# Altium schematic sheet AD9959.SchDoc
size A4
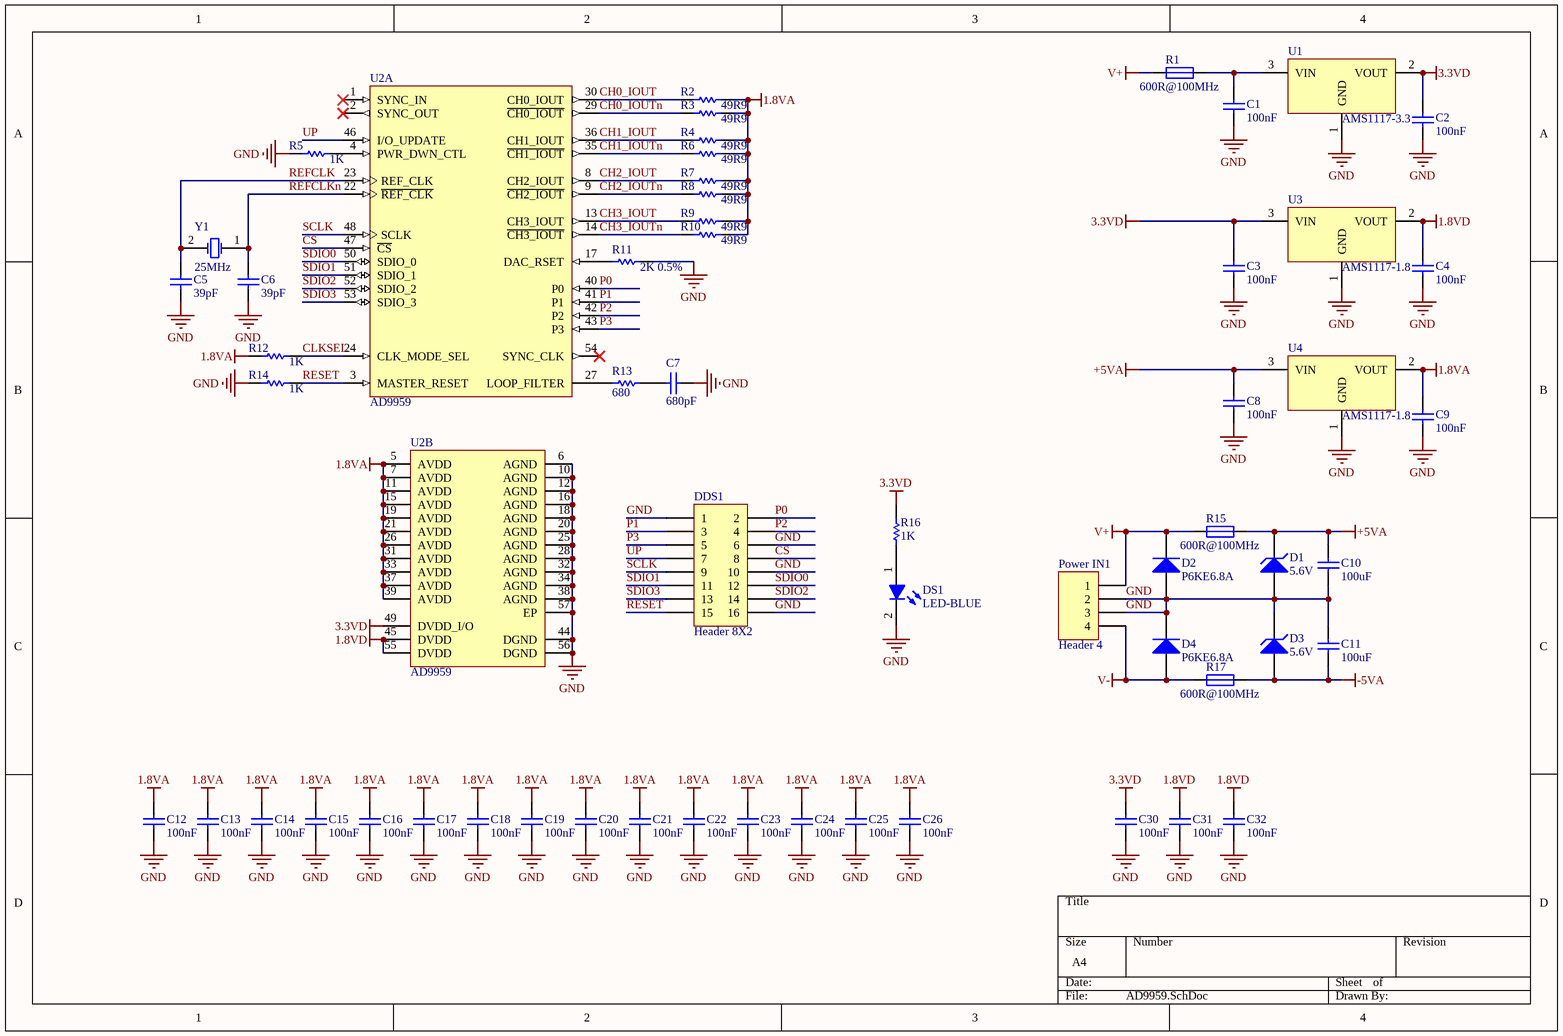
[diagram p0: AD9959.SchDoc]

## Parts
C1  100nF  [CAPC0603(1608)55_M]
C2  100nF  [CAPC0603(1608)55_M]
C3  100nF  [CAPC0603(1608)55_M]
C4  100nF  [CAPC0603(1608)55_M]
C5  39pF  [CAPC0603(1608)55_M]
C6  39pF  [CAPC0603(1608)55_M]
C7  680pF  [CAPC0603(1608)55_M]
C8  100nF  [CAPC0603(1608)55_M]
C9  100nF  [CAPC0603(1608)55_M]
C10  100uF  [CAPC3225]
C11  100uF  [CAPC3225]
C12  100nF  [CAPC0603(1608)55_M]
C13  100nF  [CAPC0603(1608)55_M]
C14  100nF  [CAPC0603(1608)55_M]
C15  100nF  [CAPC0603(1608)55_M]
C16  100nF  [CAPC0603(1608)55_M]
C17  100nF  [CAPC0603(1608)55_M]
C18  100nF  [CAPC0603(1608)55_M]
C19  100nF  [CAPC0603(1608)55_M]
C20  100nF  [CAPC0603(1608)55_M]
C21  100nF  [CAPC0603(1608)55_M]
C22  100nF  [CAPC0603(1608)55_M]
C23  100nF  [CAPC0603(1608)55_M]
C24  100nF  [CAPC0603(1608)55_M]
C25  100nF  [CAPC0603(1608)55_M]
C26  100nF  [CAPC0603(1608)55_M]
C30  100nF  [CAPC0603(1608)55_M]
C31  100nF  [CAPC0603(1608)55_M]
C32  100nF  [CAPC0603(1608)55_M]
D1  5.6V  [LL34]
D2  P6KE6.8A  [DO-214AC]
D3  5.6V  [LL34]
D4  P6KE6.8A  [DO-214AC]
DDS1  Header 8X2  [HEADER8X2]
DS1  LED-BLUE  [0603LED_BLUE_V]
Power_IN1  Header 4  [3.96-4]
R1  600R@100MHz  [RESC1206(3216)_M]
R2  49R9  [RESC0603(1608)_M]
R3  49R9  [RESC0603(1608)_M]
R4  49R9  [RESC0603(1608)_M]
R5  1K  [RESC0603(1608)_M]
R6  49R9  [RESC0603(1608)_M]
R7  49R9  [RESC0603(1608)_M]
R8  49R9  [RESC0603(1608)_M]
R9  49R9  [RESC0603(1608)_M]
R10  49R9  [RESC0603(1608)_M]
R11  2K 0.5%  [RESC0603(1608)_M]
R12  1K  [RESC0603(1608)_M]
R13  680  [RESC0603(1608)_M]
R14  1K  [RESC0603(1608)_M]
R15  600R@100MHz  [RESC1206(3216)_M]
R16  1K  [RESC0603(1608)_M]
R17  600R@100MHz  [RESC1206(3216)_M]
U1  AMS1117-3.3  [SOT-223_M]
U2  AD9959  [QFN56]  (parts A,B of 2)
U3  AMS1117-1.8  [SOT-223_M]
U4  AMS1117-1.8  [SOT-223_M]
Y1  25MHz  [HC-49S]

## Nets
1.8VA: C9.2 C12.2 C13.2 C14.2 C15.2 C16.2 C17.2 C18.2 C19.2 C20.2 C21.2 C22.2 C23.2 C24.2 C25.2 C26.2 R2.2 R3.2 R4.2 R6.2 R7.2 R8.2 R9.2 R10.2 R12.1 U2.5(AVDD) U2.7(AVDD) U2.11(AVDD) U2.15(AVDD) U2.19(AVDD) U2.21(AVDD) U2.26(AVDD) U2.31(AVDD) U2.33(AVDD) U2.37(AVDD) U2.39(AVDD) U4.2(VOUT)
1.8VD: C4.2 C31.2 C32.2 U2.45(DVDD) U2.55(DVDD) U3.2(VOUT)
3.3VD: C2.2 C3.2 C30.2 R16.2 U1.2(VOUT) U2.49(DVDD_I/O) U3.3(VIN)
+5VA: C8.2 C10.2 D1.2(K) R15.2 U4.3(VIN)
-5VA: C11.2 D3.1(A) R17.2
GND: C1.1 C2.1 C3.1 C4.1 C5.1 C6.1 C7.2 C8.1 C9.1 C10.1 C11.1 C12.1 C13.1 C14.1 C15.1 C16.1 C17.1 C18.1 C19.1 C20.1 C21.1 C22.1 C23.1 C24.1 C25.1 C26.1 C30.1 C31.1 C32.1 D1.1(A) D2.2(A) D3.2(K) D4.1(K) DDS1.1 DDS1.6 DDS1.10 DDS1.16 DS1.2(K) Power_IN1.2 Power_IN1.3 R5.1 R11.2 R14.1 U1.1(GND) U2.6(AGND) U2.10(AGND) U2.12(AGND) U2.16(AGND) U2.18(AGND) U2.20(AGND) U2.25(AGND) U2.28(AGND) U2.32(AGND) U2.34(AGND) U2.38(AGND) U2.44(DGND) U2.56(DGND) U2.57(EP) U3.1(GND) U4.1(GND)
V+: D2.1(K) Power_IN1.1 R1.1 R15.1
V-: D4.2(A) Power_IN1.4 R17.1
CH0_IOUT: R2.1 U2.30(CH0_IOUT)
CH0_IOUTn: R3.1 U2.29(~{CH0_IOUT})
CH1_IOUT: R4.1 U2.36(CH1_IOUT)
CH1_IOUTn: R6.1 U2.35(~{CH1_IOUT})
CH2_IOUT: R7.1 U2.8(CH2_IOUT)
CH2_IOUTn: R8.1 U2.9(~{CH2_IOUT})
CH3_IOUT: R9.1 U2.13(CH3_IOUT)
CH3_IOUTn: R10.1 U2.14(~{CH3_IOUT})
CLKSEL: R12.2 U2.24(CLK_MODE_SEL)
CS: DDS1.8 U2.47(~{CS})
P0: DDS1.2 U2.40(P0)
P1: DDS1.3 U2.41(P1)
P2: DDS1.4 U2.42(P2)
P3: DDS1.5 U2.43(P3)
REFCLK: C5.2 U2.23(REF_CLK) Y1.2(OSC2)
REFCLKn: C6.2 U2.22(~{REF_CLK}) Y1.1(OSC1)
RESET: DDS1.15 R14.2 U2.3(MASTER_RESET)
SCLK: DDS1.9 U2.48(SCLK)
SDIO0: DDS1.12 U2.50(SDIO_0)
SDIO1: DDS1.11 U2.51(SDIO_1)
SDIO2: DDS1.14 U2.52(SDIO_2)
SDIO3: DDS1.13 U2.53(SDIO_3)
UP: DDS1.7 U2.46(I/O_UPDATE)
NetC1_2: C1.2 R1.2 U1.3(VIN)
NetC7_1: C7.1 R13.2
NetDS1_1: DS1.1(A) R16.1
NetR5_2: R5.2 U2.4(PWR_DWN_CTL)
NetR11_1: R11.1 U2.17(DAC_RSET)
NetR13_1: R13.1 U2.27(LOOP_FILTER)

Not connected (* = marked no-connect by the designer): U2 1(SYNC_IN)* 2(SYNC_OUT)* 54(SYNC_CLK)*

## Library data of the parts
C1-C26 C30-C32 = CAP
D1 D3 = D Zener: Zener Diode; Published: 8-Jun-2000; LatestRevisionDate: 17-Jul-2002; LatestRevisionNote: Re-released for DXP Platform.; PackageReference: DIODE-0.7; Publisher: Altium Limited; PackageDescription: Diode, Thru-Hole; 2 Leads; 0.7 in Pin Spacing
D2 D4 = Diode: pin to pad: 1>2 2>1
DDS1 = Header 8X2: Header, 8-Pin, Dual row; LatestRevisionDate: 17-Jul-2002; LatestRevisionNote: Re-released for DXP Platform.; Publisher: Altium Limited
Power_IN1 = Header 4: Header, 4-Pin; LatestRevisionDate: 17-Jul-2002; LatestRevisionNote: Re-released for DXP Platform.; Publisher: Altium Limited
R1 R15 R17 = Ferrite Bead: Manufacturer: Generic Components; Class: Passive; SubClass: Resistor; Value: 4K7; Published: 08/06/2000; Publisher: Altium Hobart Technology Centre
R2-R14 R16 = RES
U1 U3 U4 = AMS1117
Y1 = XTAL: Crystal Oscillator; Published: 8-Jun-2000; LatestRevisionDate: 17-Jul-2002; LatestRevisionNote: Re-released for DXP Platform.; PackageReference: R38; Publisher: Altium Limited; PackageDescription: Crystal, Thru-Hole; 2 Leads; Body 3.1 x 8.2 mm (Dia.xH)